# Altium project ZIGBEE.PrjPCB
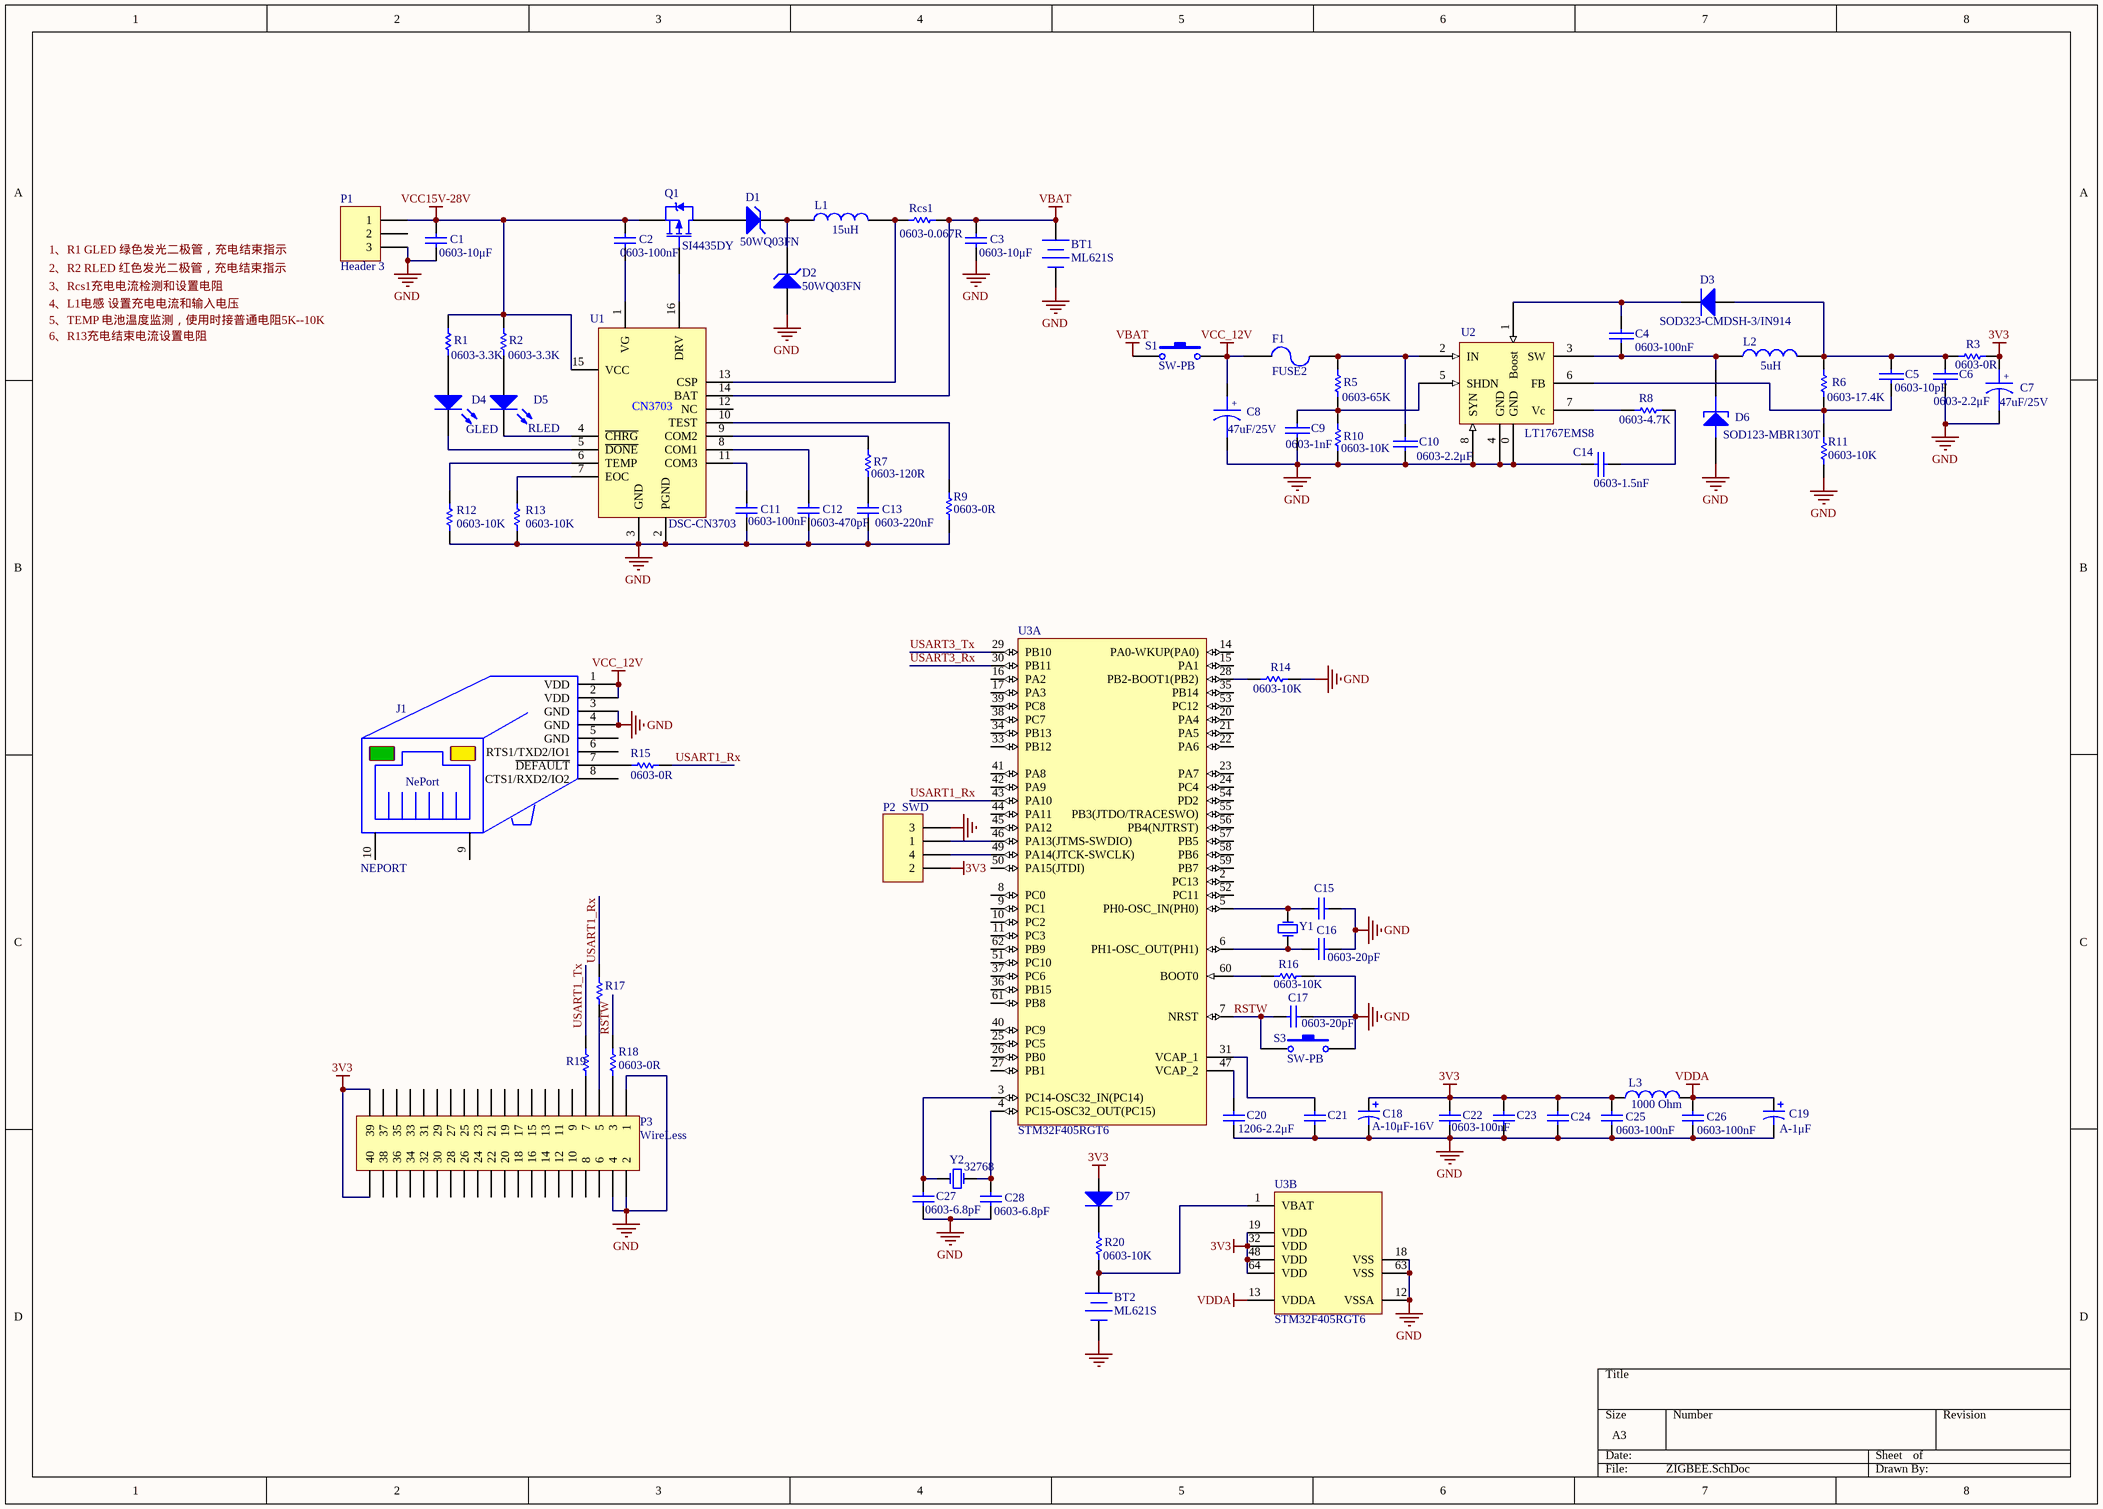
[diagram p0: ZIGBEE.SchDoc]
1 sheet, 73 parts. Net scope: global (net labels, ports and power ports of the same name join across sheets).
Board file: ZIGBEE.PcbDoc

## Sheet ZIGBEE.SchDoc
size A3

### Parts
BT1  ML621S  [TJC3-2A]
BT2  ML621S  [ML621]
C1  0603-10μF  [0603C]
C2  0603-100nF  [0603C]
C3  0603-10μF  [0603C]
C4  0603-100nF  [0603C]
C5  0603-10pF  [0603C]
C6  0603-2.2μF  [0603C]
C7  47uF/25V  [SMD-47uF/25V]
C8  47uF/25V  [SMD-47uF/25V]
C9  0603-1nF  [0603C]
C10  0603-2.2μF  [0603C]
C11  0603-100nF  [0603C]
C12  0603-470pF  [0603C]
C13  0603-220nF  [0603C]
C14  0603-1.5nF  [0603C]
C15  0603-20pF  [0603C]  (value not drawn)
C16  0603-20pF  [0603C]
C17  0603-20pF  [0603C]
C18  A-10μF-16V  [TANA]
C19  A-1μF  [TANA]
C20  1206-2.2μF  [1206C]
C21  1206-2.2μF  [1206C]  (value not drawn)
C22  0603-100nF  [0603C]
C23  0603-100nF  [0603C]  (value not drawn)
C24  0603-100nF  [0603C]  (value not drawn)
C25  0603-100nF  [0603C]
C26  0603-100nF  [0603C]
C27  0603-6.8pF  [0603C]
C28  0603-6.8pF  [0603C]
D1  50WQ03FN  [DO-214AC]
D2  50WQ03FN  [DO-214AC]
D3  SOD323-CMDSH-3/IN914  [SOD-323]
D4  GLED  [0603D]
D5  RLED  [0603D]
D6  SOD123-MBR130T  [SOD123/X.85]
D7  1N4148  [SOD-80/MLL34]  (value not drawn)
F1  FUSE2  [0603]
J1  NEPORT  [RJ45_8P8C]
L1  15uH  [SMD]
L2  5uH  [SMD]
L3  1000 Ohm  [INDC4516AM]
P1  Header 3  [XH-2.54-3]
P2  SWD  [HDR1X4]
P3  WireLess  [SMALL/MIDDLE OEM MODEM]
Q1  SI4435DY  [TO-220AB]
R1  0603-3.3K  [0603]
R2  0603-3.3K  [0603]
R3  0603-0R  [0603]
R5  0603-65K  [0603]
R6  0603-17.4K  [0603]
R7  0603-120R  [0603]
R8  0603-4.7K  [0603]
R9  0603-0R  [0603]
R10  0603-10K  [0603]
R11  0603-10K  [0603]
R12  0603-10K  [0603]
R13  0603-10K  [0603]
R14  0603-10K  [0603]
R15  0603-0R  [0603]
R16  0603-10K  [0603]
R17  0603-0R  [0603]  (value not drawn)
R18  0603-0R  [0603]
R19  0603-0R  [0603]  (value not drawn)
R20  0603-10K  [0603]
Rcs1  0603-0.067R  [0603]
S1  SW-PB  [TJC3-2A]
S3  SW-PB  [SW3*4*2MM]
U1  DSC-CN3703  [TSSOP16]
U2  LT1767EMS8  [MS8_N]
U3  STM32F405RGT6  [TQFP64_M]  (parts A,B of 2)
Y1  8MHz  [XTAL]  (value not drawn)
Y2  32768  [1206CY]

### Nets
3V3: C7.1 C18.1 C22.2 C23.2 C24.2 C25.2 D7.1(A) L3.1 P2.2 P3.39 P3.40 R3.2 U3.19(VDD) U3.32(VDD) U3.48(VDD) U3.64(VDD)
GND: BT1.1(-) BT2.1(-) C1.2 C3.2 C6.2 C7.2 C8.2 C9.2 C10.2 C11.2 C12.2 C13.2 C14.1 C15.1 C16.1 C17.1 C18.2 C19.2 C20.1 C21.1 C22.1 C23.1 C24.1 C25.1 C26.1 C27.2 C28.2 D2.1(A) D6.1(A) J1.3(GND) J1.4(GND) P1.3 P2.3 P3.1 P3.2 P3.4 R9.2 R10.1 R11.1 R12.2 R13.2 R14.2 R16.2 S3.2 U1.2(PGND) U1.3(GND) U2.0(GND) U2.4(GND) U2.8(SYN) U3.12(VSSA) U3.18(VSS) U3.63(VSS)
VBAT: BT1.2(+) C3.1 Rcs1.1 S1.1 U1.14(BAT)
VCC15V-28V: C1.1 C2.1 P1.1 Q1.3(S) R1.2 R2.2 U1.15(VCC)
VCC_12V: C8.1 F1.1 J1.1(VDD) J1.2(VDD) S1.2
VDDA: C19.1 C26.2 L3.2 U3.13(VDDA)
RSTW: C17.2 R18.1 S3.1 U3.7(NRST)
USART1_Rx: R15.1 R17.1 U3.43(PA10)
USART1_Tx: R19.1
USART3_Rx: U3.30(PB11)
USART3_Tx: U3.29(PB10)
NetBT2_2: BT2.2(+) R20.2 U3.1(VBAT)
NetC2_2: C2.2 U1.1(VG)
NetC4_1: C4.1 D3.2(K) U2.1(Boost)
NetC4_2: C4.2 D6.2(K) L2.1 U2.3(SW)
NetC5_1: C5.1 C6.1 D3.1(A) L2.2 R3.1 R6.2
NetC5_2: C5.2 R6.1 R11.2 U2.6(FB)
NetC9_1: C9.1 R5.1 R10.2 U2.5(SHDN)
NetC10_1: C10.1 F1.2 R5.2 U2.2(IN)
NetC11_1: C11.1 U1.11(COM3)
NetC12_1: C12.1 U1.8(COM1)
NetC13_1: C13.1 R7.2
NetC14_2: C14.2 R8.1
NetC15_2: C15.2 U3.5(PH0-OSC_IN(PH0)) Y1.2(OSC2)
NetC16_2: C16.2 U3.6(PH1-OSC_OUT(PH1)) Y1.1(OSC1)
NetC20_2: C20.2 U3.47(VCAP_2)
NetC21_2: C21.2 U3.31(VCAP_1)
NetC27_1: C27.1 U3.3(PC14-OSC32_IN(PC14)) Y2.2(OSC2)
NetC28_1: C28.1 U3.4(PC15-OSC32_OUT(PC15)) Y2.1(OSC1)
NetD1_1: D1.1(A) Q1.2(D)
NetD1_2: D1.2(K) D2.2(K) L1.1
NetD4_1: D4.1(A) R1.1
NetD4_2: D4.2(K) U1.5(~{DONE})
NetD5_1: D5.1(A) R2.1
NetD5_2: D5.2(K) U1.4(~{CHRG})
NetD7_2: D7.2(K) R20.1
NetJ1_7: J1.7(~{DEFAULT}) R15.2
NetL1_2: L1.2 Rcs1.2 U1.13(CSP)
NetP2_1: P2.1 U3.46(PA13(JTMS-SWDIO))
NetP2_4: P2.4 U3.49(PA14(JTCK-SWCLK))
NetP3_3: P3.3 R18.2
NetP3_5: P3.5 R17.2
NetP3_7: P3.7 R19.2
NetQ1_1: Q1.1(G) U1.16(DRV)
NetR7_1: R7.1 U1.9(COM2)
NetR8_2: R8.2 U2.7(Vc)
NetR9_1: R9.1 U1.10(TEST)
NetR12_1: R12.1 U1.6(TEMP)
NetR13_1: R13.1 U1.7(EOC)
NetR14_1: R14.1 U3.28(PB2-BOOT1(PB2))
NetR16_1: R16.1 U3.60(BOOT0)

Not connected (* = marked no-connect by the designer): J1 5(GND) 6(RTS1/TXD2/IO1) 8(CTS1/RXD2/IO2) 9(SHELL) 10(SHELL); P1 2; P3 6 8 9 10 11 12 13 14 15 16 17 18 19 20 21 22 23 24 25 26 27 28 29 30 31 32 33 34 35 36 37 38; U1 12(NC); U3 2(PC13) 8(PC0) 9(PC1) 10(PC2) 11(PC3) 14(PA0-WKUP(PA0)) 15(PA1) 16(PA2) 17(PA3) 20(PA4) 21(PA5) 22(PA6) 23(PA7) 24(PC4) 25(PC5) 26(PB0) 27(PB1) 33(PB12) 34(PB13) 35(PB14) 36(PB15) 37(PC6) 38(PC7) 39(PC8) 40(PC9) 41(PA8) 42(PA9) 44(PA11) 45(PA12) 50(PA15(JTDI)) 51(PC10) 52(PC11) 53(PC12) 54(PD2) 55(PB3(JTDO/TRACESWO)) 56(PB4(NJTRST)) 57(PB5) 58(PB6) 59(PB7) 61(PB8) 62(PB9)

### Notes on the sheet
- Labels drawn without touching a wire or pin: 1、R1 GLED 绿色发光二极管，充电结束指示, 2、R2 RLED 红色发光二极管，充电结束指示, 3、Rcs1充电电流检测和设置电阻, 4、L1电感 设置充电电流和输入电压, 5、TEMP 电池温度监测，使用时接普通电阻5K--10K, 6、R13充电结束电流设置电阻
- (in symbol DSC-CN3703) CN3703
- (in symbol NEPORT) NePort
- (in symbol 电解电容) +

### Library data of the parts
BT1 BT2 = Battery: Multicell Battery; Published: 24-Mar-1999; LatestRevisionDate: 17-Jul-2002; LatestRevisionNote: Re-released for DXP Platform.; PackageReference: BAT-2; Publisher: Altium Limited
C1-C3 C11-C13 C15-C17 C20-C28 = Cap: Capacitor; Published: 8-Jun-2000; LatestRevisionDate: 17-Jul-2002; LatestRevisionNote: Re-released for DXP Platform.; PackageReference: RAD-0.3; Publisher: Altium Limited; PackageDescription: Radial Cap, Thru-Hole; 2 Leads; 0.3 in Pin Spacing
  C1 C3: Value: 0603-10μF
  C2 C11 C22-C26: Value: 0603-100nF
  C12: Value: 0603-470pF
  C13: Value: 0603-220nF
  C15-C17: Value: 0603-20pF
  C20 C21: Value: 1206-2.2μF
  C27 C28: Value: 0603-6.8pF
C4-C6 C9 C10 C14 = 普通电容: Capacitor
C7 C8 = 电解电容: Capacitor
C18 = Cap Pol1: Polarized Capacitor (Radial); Published: 8-Jun-2000; LatestRevisionDate: 17-Jul-2002; LatestRevisionNote: Re-released for DXP Platform.; PackageReference: RB7.6-15; Publisher: Altium Limited; PackageDescription: Polarized Capacitor (Radial); 2 Leads; Value: A-10μF-16V
C19 = Cap Pol1: Polarized Capacitor (Radial); Value: 1μF; Published: 8-Jun-2000; LatestRevisionDate: 17-Jul-2002; LatestRevisionNote: Re-released for DXP Platform.; PackageReference: RB7.6-15; Publisher: Altium Limited; PackageDescription: Polarized Capacitor (Radial); 2 Leads
D1 D2 = D Zener: Zener Diode; Published: 8-Jun-2000; LatestRevisionDate: 17-Jul-2002; LatestRevisionNote: Re-released for DXP Platform.; PackageReference: DIODE-0.7; Publisher: Altium Limited
D3 = DIODE
D4 D5 = LED0: Typical INFRARED GaAs LED; Published: 8-Jun-2000; LatestRevisionDate: 08-Jul-2005; LatestRevisionNote: Mech Layer 1 removed.; PackageReference: LED-0; Publisher: Altium Limited
D6 = TUNNEL: Tunnel FDiode
D7 = Diode 1N4148: High Conductance Fast Diode; Published: 8-Jun-2000; LatestRevisionDate: 17-Jul-2002; LatestRevisionNote: Re-released for DXP Platform.; DatasheetVersion: 1997; PackageReference: DO-35; Publisher: Altium Limited; PackageDescription: Diode, Axial; Body 3.8 x 1.9 mm (LxDia. max), Lead Dia. 0.53 mm (max); Code_JEDEC: DO-204-AH; ComponentLink1Description: Manufacturer Link; ComponentLink1URL: http://www.fairchildsemi.com/; ComponentLink2Description: Datasheet; ComponentLink2URL: http://www.fairchildsemi.com/ds/1N%2F1N4148.pdf
F1 = FUSE2: Fuse
J1 = NEPORT: serial to ethernet RJ45 jack
L1 L2 = INDUCTOR
L3 = Inductor: BLM41PG102SN1L\CBW451616U900; Code_IEC: 1005; Published: 8-Jun-2000; LatestRevisionDate: 29-May-2009; LatestRevisionNote: IPC-7351 Footprint Added.; PackageReference: 0402-A; Publisher: Altium Limited; PackageDescription: Chip Inductor; Code_JEITA: 0402; Value: 1000 Ohm
P1 = Header 3: Header, 3-Pin; LatestRevisionDate: 17-Jul-2002; LatestRevisionNote: Re-released for DXP Platform.; Publisher: Altium Limited
P2 = Header 4: Header, 4-Pin; LatestRevisionDate: 17-Jul-2002; LatestRevisionNote: Re-released for DXP Platform.; Publisher: Altium Limited
P3 = Header 20X2: Header, 20-Pin, Dual row; LatestRevisionDate: 17-Jul-2002; LatestRevisionNote: Re-released for DXP Platform.; Publisher: Altium Limited
Q1 = PMOS-2: P-Channel Power MOSFET; Note: Pin 4 not drawn and electrically connected to Pin 2.; Published: 8-Jun-2000; LatestRevisionDate: 17-Jul-2002; LatestRevisionNote: Re-released for DXP Platform.; DatasheetDocument: PD-9.390D; PackageReference: TO-220AB; Publisher: Altium Limited; Code_JEDEC: TO-220-AB; ComponentLink1Description: Manufacturer Link; ComponentLink1URL: http://www.irf.com/
R1-R3 R5-R14 R16 R20 Rcs1 = Res1: Resistor; Published: 8-Jun-2000; LatestRevisionDate: 17-Jul-2002; LatestRevisionNote: Re-released for DXP Platform.; PackageReference: AXIAL-0.3; Publisher: Altium Limited; PackageDescription: Axial Device, Thru-Hole; 2 Leads; 0.3 in Pin Spacing
  R1 R2: Value: 0603-3.3K
  R3 R9: Value: 0603-0R
  R5: Value: 0603-65K
  R6: Value: 0603-17.4K
  R7: Value: 0603-120R
  R8: Value: 0603-4.7K
  R10-R14 R16 R20: Value: 0603-10K
  Rcs1: Value: 0603-0.067R
R15 R17-R19 = Res1: Resistor; Rule: PcbType=ProtelPcb; Published: 8-Jun-2000; LatestRevisionDate: 17-Jul-2002; LatestRevisionNote: Re-released for DXP Platform.; PackageReference: AXIAL-0.3; Publisher: Altium Limited; PackageDescription: Axial Device, Thru-Hole; 2 Leads; 0.3 in Pin Spacing; Value: 0603-0R
S1 S3 = SW-PB: Switch; Published: 24-Mar-1999; LatestRevisionDate: 17-Jul-2002; LatestRevisionNote: Re-released for DXP Platform.; PackageReference: SPST-2; Publisher: Altium Limited
U3 = STM32F405RGT6: ARM Cortex-M4 32-bit MCU+FPU, 210 DMIPS, 1024 kB Flash, 192 kB Internal RAM, 51 I/Os, 64-pin LQFP, -40 to 85 degC, Tray; Manufacturer: STMicroelectronics; D/A Converter: 2x12-bit; FLASH Size (Prog) (kB): 1024; I/Os (High Current): 51; Internal RAM Size (kB): 192; Operating Frequency(F) (Processor speed) (MHz): 168; Supply Voltage(Vcc) max (V): 3.6; Supply Voltage(Vcc) min (V): 1.8; DatasheetVersion: Rev. 4; PackageVersion: Rev. 4, 06/2013; PackageReference: LQFP64; PackageDescription: 64-Pin Low Profile Quad Flat Package, 10 x 10 mm Body, 0.5 mm Pitch; Supplier 1: Digi-Key; Supplier Part Number 1: 497-11767-ND; Supplier 2: Farnell; Supplier Part Number 2: 2064363; Supplier 3: Newark; Supplier Part Number 3: 73T2329; Supplier 4: Mouser; Supplier Part Number 4: 511-STM32F405RGT6; Core: ARM Cortex-M4; Packing: Tray; Mounting Technology: Surface Mount; PartNumber: STM32F405RGT6; ComponentLink1Description: Manufacturer URL; ComponentLink1URL: http://www.st.com/web/en/home.html; ComponentLink2Description: Datasheet; ComponentLink2URL: http://www.st.com/st-web-ui/static/active/en/resource/technical/document/datasheet/DM00037051.pdf; ComponentLink3Description: Package Specification; ComponentLink3URL: http://www.st.com/st-web-ui/static/active/en/resource/technical/document/datasheet/DM00037051.pdf
Y1 Y2 = XTAL: Crystal Oscillator; Published: 8-Jun-2000; LatestRevisionDate: 17-Jul-2002; LatestRevisionNote: Re-released for DXP Platform.; PackageReference: R38; Publisher: Altium Limited; PackageDescription: Crystal, Thru-Hole; 2 Leads; Body 3.1 x 8.2 mm (Dia.xH)